# Altium schematic sheet AmpliRF.SchDoc
size A4
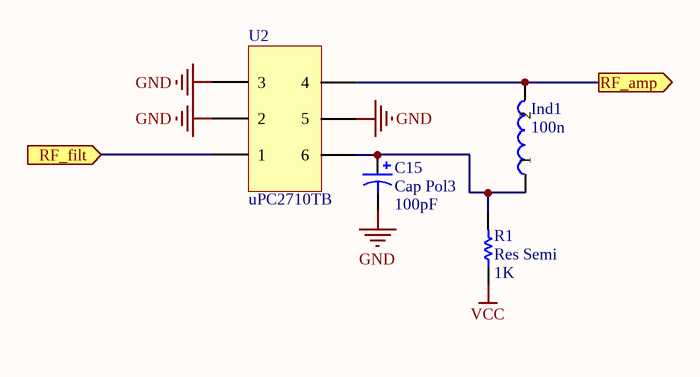
[diagram p0: AmpliRF.SchDoc]

## Parts
C15  Cap Pol3  value 100pF  [C0805]
Ind1  Valor: 100n  [NTH12_2]  (hidden comment: Ind2)
R1  Res Semi  value 1K  [2012[0805]]
U2  uPC2710TB  [UPC2710TB2]

## Ports
RF_amp (out), RF_filt (in)

## Nets
GND: C15.2 U2.GND1(2) U2.GND2(3) U2.GND3(5)
VCC: R1.1
RF_amp: Ind1.2 U2.RF_OUT(4) ; port RF_amp
RF_filt: U2.RF_IN(1) ; port RF_filt
NetC15_1: C15.1 Ind1.1 R1.2 U2.Vcc(6)

## Library data of the parts
C15 = Cap Pol3: Polarized Capacitor (Surface Mount); Published: 8-Jun-2000; LatestRevisionDate: 17-Jul-2002; LatestRevisionNote: Re-released for DXP Platform.; PackageReference: C0805; Publisher: Altium Limited
R1 = Res Semi: Semiconductor Resistor; Published: 8-Jun-2000; LatestRevisionDate: 17-Jul-2002; LatestRevisionNote: Re-released for DXP Platform.; PackageReference: AXIAL-0.5; Publisher: Altium Limited
U2 = uPC2710TB: pin to pad: GND1>2 GND2>3 GND3>5 RF_IN>1 RF_OUT>4 Vcc>6